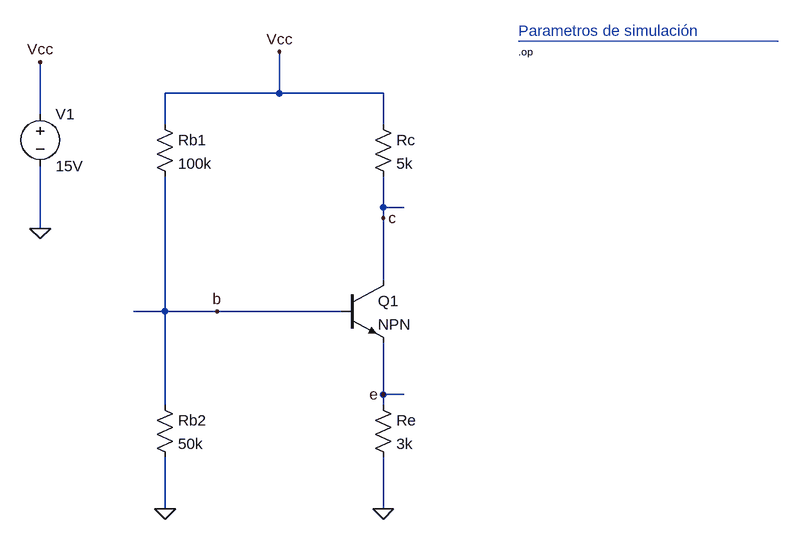
[diagram p0: schematic ejemplo_5-10.asc]
ejemplo_5-10.asc, the LTspice schematic file:
Version 4
SHEET 1 1376 680
WIRE -80 -288 -80 -352
WIRE -80 -288 -256 -288
WIRE 80 -288 -80 -288
WIRE -448 -256 -448 -336
WIRE -256 -240 -256 -288
WIRE 80 -240 80 -288
WIRE 80 -112 80 -160
WIRE 112 -112 80 -112
WIRE 80 -96 80 -112
WIRE -448 -80 -448 -176
WIRE 80 0 80 -96
WIRE -256 48 -256 -160
WIRE -256 48 -304 48
WIRE -176 48 -256 48
WIRE 16 48 -176 48
WIRE 80 176 80 96
WIRE 112 176 80 176
WIRE -256 192 -256 48
WIRE 80 192 80 176
WIRE -256 352 -256 272
WIRE 80 352 80 272
FLAG 80 352 0
FLAG 80 -96 c
FLAG 80 176 e
FLAG -176 48 b
FLAG -80 -352 Vcc
FLAG -448 -80 0
FLAG -256 352 0
FLAG -448 -336 Vcc
DATAFLAG 112 176 ""
DATAFLAG 112 -112 ""
DATAFLAG -160 80 "Ib(Q1)"
DATAFLAG 176 144 "Ie(Q1)"
DATAFLAG 176 -48 "Ic(Q1)"
DATAFLAG -304 48 ""
SYMBOL res 64 -256 R0
SYMATTR InstName Rc
SYMATTR Value 5k
SYMBOL npn 16 0 R0
SYMATTR InstName Q1
SYMBOL voltage -448 -272 R0
SYMATTR InstName V1
SYMATTR Value 15V
SYMBOL res 64 176 R0
SYMATTR InstName Re
SYMATTR Value 3k
SYMBOL res -272 -256 R0
SYMATTR InstName Rb1
SYMATTR Value 100k
SYMBOL res -272 176 R0
SYMATTR InstName Rb2
SYMATTR Value 50k
TEXT 288 -384 Left 2 ;Parametros de simulación
TEXT 288 -352 Left 1 !.op
LINE Normal 688 -368 288 -368
LINE Normal 688 -368 688 -368 2
LINE Normal 688 -368 688 -368 2

The netlist it stands for:
* ejemplo_5-10.asc
Rc Vcc c 5k
Q1 c b e 0 NPN
V1 Vcc 0 15V
Re e 0 3k
Rb1 Vcc b 100k
Rb2 b 0 50k
.model NPN NPN
.model PNP PNP
.lib standard.bjt
* Parametros de simulación
.op
.backanno
.end